# Altium schematic sheet TUSB4041_PINOUT.SchDoc
size C; SheetNumber: 17; SheetTotal: 21
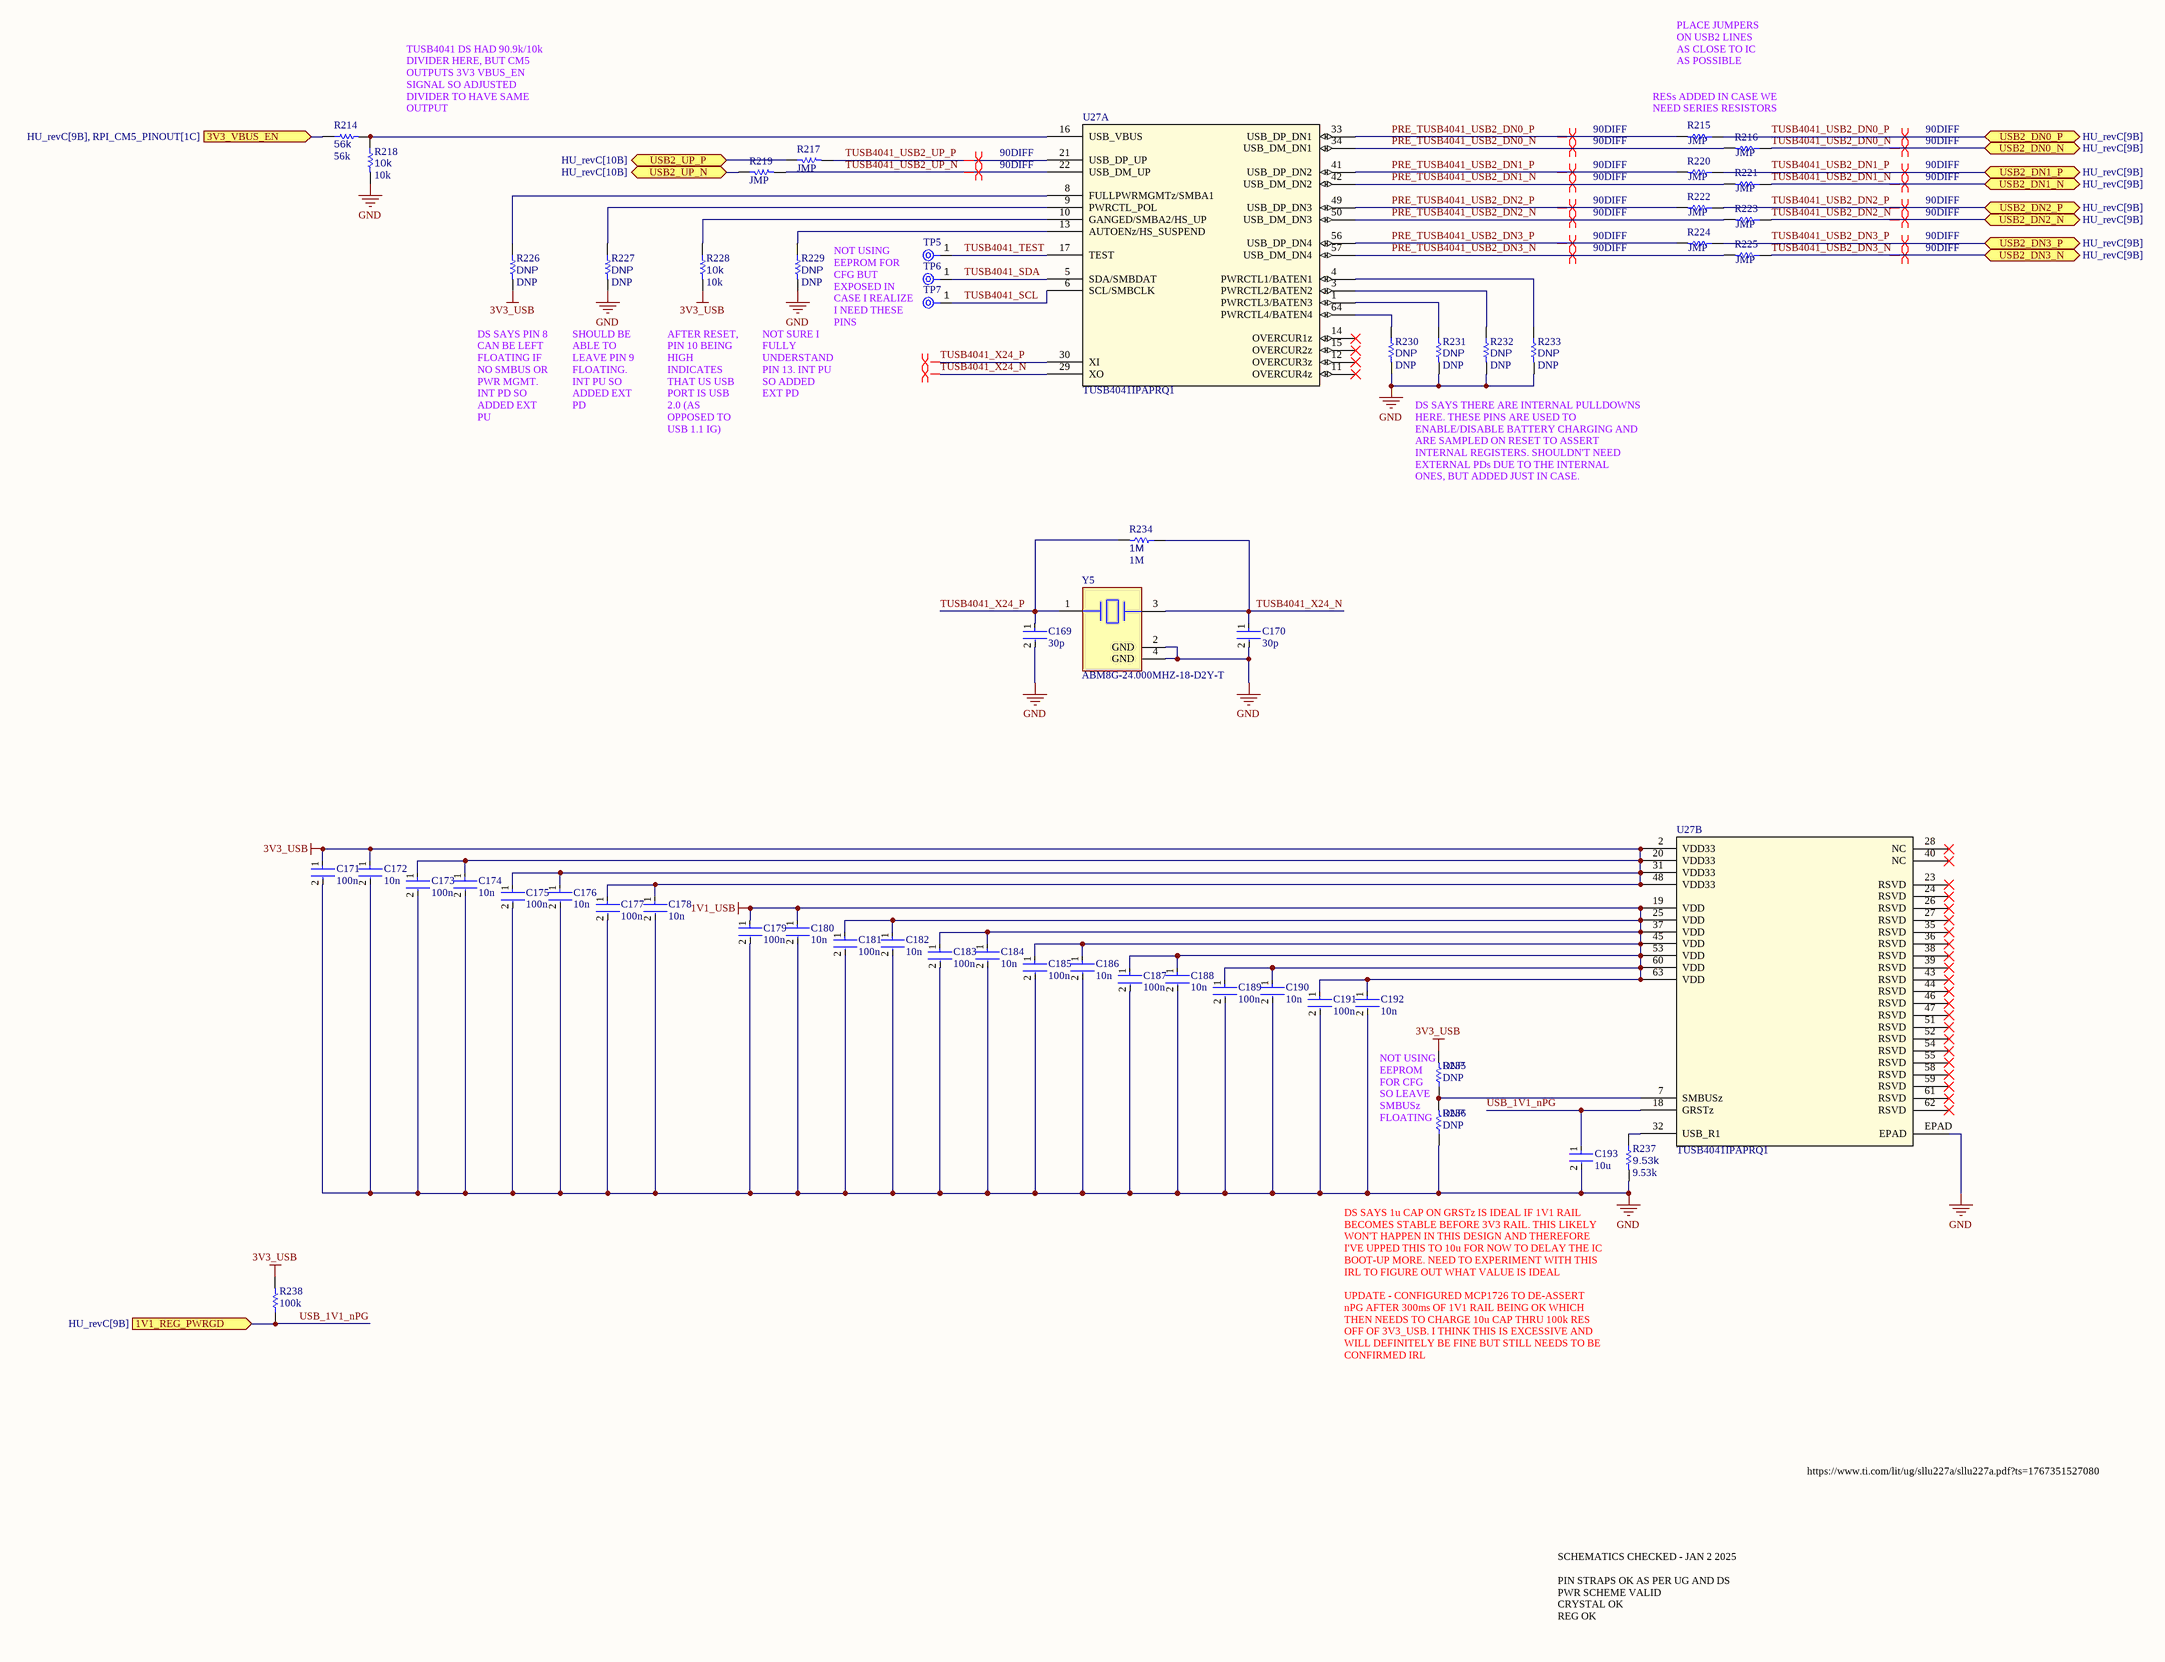
[diagram p0: TUSB4041_PINOUT.SchDoc]

## Parts
C169  30p  [FP-0402-L_1_0_0_05-W_0_5-IPC_A]
C170  30p  [FP-0402-L_1_0_0_05-W_0_5-IPC_A]
C171  100n  [FP-0402-L_1_0_0_05-W_0_5-IPC_A]
C172  10n  [FP-0402-L_1_0_0_05-W_0_5-IPC_A]
C173  100n  [FP-0402-L_1_0_0_05-W_0_5-IPC_A]
C174  10n  [FP-0402-L_1_0_0_05-W_0_5-IPC_A]
C175  100n  [FP-0402-L_1_0_0_05-W_0_5-IPC_A]
C176  10n  [FP-0402-L_1_0_0_05-W_0_5-IPC_A]
C177  100n  [FP-0402-L_1_0_0_05-W_0_5-IPC_A]
C178  10n  [FP-0402-L_1_0_0_05-W_0_5-IPC_A]
C179  100n  [FP-0402-L_1_0_0_05-W_0_5-IPC_A]
C180  10n  [FP-0402-L_1_0_0_05-W_0_5-IPC_A]
C181  100n  [FP-0402-L_1_0_0_05-W_0_5-IPC_A]
C182  10n  [FP-0402-L_1_0_0_05-W_0_5-IPC_A]
C183  100n  [FP-0402-L_1_0_0_05-W_0_5-IPC_A]
C184  10n  [FP-0402-L_1_0_0_05-W_0_5-IPC_A]
C185  100n  [FP-0402-L_1_0_0_05-W_0_5-IPC_A]
C186  10n  [FP-0402-L_1_0_0_05-W_0_5-IPC_A]
C187  100n  [FP-0402-L_1_0_0_05-W_0_5-IPC_A]
C188  10n  [FP-0402-L_1_0_0_05-W_0_5-IPC_A]
C189  100n  [FP-0402-L_1_0_0_05-W_0_5-IPC_A]
C190  10n  [FP-0402-L_1_0_0_05-W_0_5-IPC_A]
C191  100n  [FP-0402-L_1_0_0_05-W_0_5-IPC_A]
C192  10n  [FP-0402-L_1_0_0_05-W_0_5-IPC_A]
C193  10u  [FP-0402-L_1_0_0_05-W_0_5-IPC_A]
R214  56k  [R0603B]
R215  JMP  [R0603B]
R216  JMP  [R0603B]
R217  JMP  [R0603B]
R218  10k  [R0603B]
R219  JMP  [R0603B]
R220  JMP  [R0603B]
R221  JMP  [R0603B]
R222  JMP  [R0603B]
R223  JMP  [R0603B]
R224  JMP  [R0603B]
R225  JMP  [R0603B]
R226  DNP  [R0603B]
R227  DNP  [R0603B]
R228  10k  [R0603B]
R229  DNP  [R0603B]
R230  DNP  [R0603B]
R231  DNP  [R0603B]
R232  DNP  [R0603B]
R233  DNP  [R0603B]
R234  1M  [R0603B]
R235  DNP  [R0603B]
R236  DNP  [R0603B]
R237  9.53k  [R0603B]
R238  100k  [R0603B]
TP5  TPAD6R  [New footprint 1]  (value not drawn)  (no BOM)
TP6  TPAD6R  [New footprint 1]  (value not drawn)  (no BOM)
TP7  TPAD6R  [New footprint 1]  (value not drawn)  (no BOM)
U27  TUSB4041IPAPRQ1  [TUSB4041IPAPRQ1-Footprint-1]  (parts A,B of 2)
Y5  ABM8G-24.000MHZ-18-D2Y-T  [FP-ABM8G-MFG]

## Ports
1V1_REG_PWRGD (in, see HU_revC[9B]), 3V3_VBUS_EN (in, see HU_revC[9B], RPI_CM5_PINOUT[1C]), USB2_DN0_N (bidir, see HU_revC[9B]), USB2_DN0_P (bidir, see HU_revC[9B]), USB2_DN1_N (bidir, see HU_revC[9B]), USB2_DN1_P (bidir, see HU_revC[9B]), USB2_DN2_N (bidir, see HU_revC[9B]), USB2_DN2_P (bidir, see HU_revC[9B]), USB2_DN3_N (bidir, see HU_revC[9B]), USB2_DN3_P (bidir, see HU_revC[9B]), USB2_UP_N (bidir, see HU_revC[10B]), USB2_UP_P (bidir, see HU_revC[10B])

## Nets
1V1_USB: C179.1 C180.1 C181.1 C182.1 C183.1 C184.1 C185.1 C186.1 C187.1 C188.1 C189.1 C190.1 C191.1 C192.1 U27.19(VDD) U27.25(VDD) U27.37(VDD) U27.45(VDD) U27.53(VDD) U27.60(VDD) U27.63(VDD)
3V3_USB: C171.1 C172.1 C173.1 C174.1 C175.1 C176.1 C177.1 C178.1 R226.2 R228.2 R235.2 R238.2 U27.2(VDD33) U27.20(VDD33) U27.31(VDD33) U27.48(VDD33)
GND: C169.2 C170.2 C171.2 C172.2 C173.2 C174.2 C175.2 C176.2 C177.2 C178.2 C179.2 C180.2 C181.2 C182.2 C183.2 C184.2 C185.2 C186.2 C187.2 C188.2 C189.2 C190.2 C191.2 C192.2 C193.2 R218.2 R227.2 R229.2 R230.2 R231.2 R232.2 R233.2 R236.1 R237.2 U27.EPAD Y5.2(GND) Y5.4(GND)
3V3_VBUS_EN: R214.1 ; port 3V3_VBUS_EN
PRE_TUSB4041_USB2_DN0_N: R216.2 U27.34(USB_DM_DN1)
PRE_TUSB4041_USB2_DN0_P: R215.2 U27.33(USB_DP_DN1)
PRE_TUSB4041_USB2_DN1_N: R221.2 U27.42(USB_DM_DN2)
PRE_TUSB4041_USB2_DN1_P: R220.2 U27.41(USB_DP_DN2)
PRE_TUSB4041_USB2_DN2_N: R223.2 U27.50(USB_DM_DN3)
PRE_TUSB4041_USB2_DN2_P: R222.2 U27.49(USB_DP_DN3)
PRE_TUSB4041_USB2_DN3_N: R225.2 U27.57(USB_DM_DN4)
PRE_TUSB4041_USB2_DN3_P: R224.2 U27.56(USB_DP_DN4)
TUSB4041_SCL: TP7.1(TP) U27.6(SCL/SMBCLK)
TUSB4041_SDA: TP6.1(TP) U27.5(SDA/SMBDAT)
TUSB4041_TEST: TP5.1(TP) U27.17(TEST)
TUSB4041_USB2_DN0_N: R216.1 ; port USB2_DN0_N
TUSB4041_USB2_DN0_P: R215.1 ; port USB2_DN0_P
TUSB4041_USB2_DN1_N: R221.1 ; port USB2_DN1_N
TUSB4041_USB2_DN1_P: R220.1 ; port USB2_DN1_P
TUSB4041_USB2_DN2_N: R223.1 ; port USB2_DN2_N
TUSB4041_USB2_DN2_P: R222.1 ; port USB2_DN2_P
TUSB4041_USB2_DN3_N: R225.1 ; port USB2_DN3_N
TUSB4041_USB2_DN3_P: R224.1 ; port USB2_DN3_P
TUSB4041_USB2_UP_N: R219.2 U27.22(USB_DM_UP)
TUSB4041_USB2_UP_P: R217.2 U27.21(USB_DP_UP)
TUSB4041_X24_N: C170.1 R234.1 U27.29(XO) Y5.3
TUSB4041_X24_P: C169.1 R234.2 U27.30(XI) Y5.1
USB2_UP_N: R219.1 ; port USB2_UP_N
USB2_UP_P: R217.1 ; port USB2_UP_P
USB_1V1_nPG: C193.1 R238.1 U27.18(GRSTz) ; port 1V1_REG_PWRGD
NetR214_2: R214.2 R218.1 U27.16(USB_VBUS)
NetR226_1: R226.1 U27.8(FULLPWRMGMTz/SMBA1)
NetR227_1: R227.1 U27.9(PWRCTL_POL)
NetR228_1: R228.1 U27.10(GANGED/SMBA2/HS_UP)
NetR229_1: R229.1 U27.13(AUTOENz/HS_SUSPEND)
NetR230_1: R230.1 U27.64(PWRCTL4/BATEN4)
NetR231_1: R231.1 U27.1(PWRCTL3/BATEN3)
NetR232_1: R232.1 U27.3(PWRCTL2/BATEN2)
NetR233_1: R233.1 U27.4(PWRCTL1/BATEN1)
NetR235_1: R235.1 R236.2 U27.7(SMBUSz)
NetR237_1: R237.1 U27.32(USB_R1)

Not connected (* = marked no-connect by the designer): U27 11(OVERCUR4z)* 12(OVERCUR3z)* 14(OVERCUR1z)* 15(OVERCUR2z)* 23(RSVD)* 24(RSVD)* 26(RSVD)* 27(RSVD)* 28(NC)* 35(RSVD)* 36(RSVD)* 38(RSVD)* 39(RSVD)* 40(NC)* 43(RSVD)* 44(RSVD)* 46(RSVD)* 47(RSVD)* 51(RSVD)* 52(RSVD)* 54(RSVD)* 55(RSVD)* 58(RSVD)* 59(RSVD)* 61(RSVD)* 62(RSVD)*

## Layout directives
differential pair: TUSB4041_X24_N, TUSB4041_X24_P
differential pair; differential pair class 90DIFF: PRE_TUSB4041_USB2_DN0_N, PRE_TUSB4041_USB2_DN0_P, PRE_TUSB4041_USB2_DN1_N, PRE_TUSB4041_USB2_DN1_P, PRE_TUSB4041_USB2_DN2_N, PRE_TUSB4041_USB2_DN2_P, PRE_TUSB4041_USB2_DN3_N, PRE_TUSB4041_USB2_DN3_P, TUSB4041_USB2_DN0_N, TUSB4041_USB2_DN0_P, TUSB4041_USB2_DN1_N, TUSB4041_USB2_DN1_P, TUSB4041_USB2_DN2_N, TUSB4041_USB2_DN2_P, TUSB4041_USB2_DN3_N, TUSB4041_USB2_DN3_P, TUSB4041_USB2_UP_N, TUSB4041_USB2_UP_P

## Notes on the sheet
- PLACE JUMPERS ON USB2 LINES AS CLOSE TO IC AS POSSIBLE
- TUSB4041 DS HAD 90.9k/10k DIVIDER HERE, BUT CM5 OUTPUTS 3V3 VBUS_EN SIGNAL SO ADJUSTED DIVIDER TO HAVE SAME OUTPUT
- RESs ADDED IN CASE WE NEED SERIES RESISTORS
- NOT USING EEPROM FOR CFG BUT EXPOSED IN CASE I REALIZE I NEED THESE PINS
- DS SAYS PIN 8 CAN BE LEFT FLOATING IF NO SMBUS OR PWR MGMT. INT PD SO ADDED EXT PU
- SHOULD BE ABLE TO LEAVE PIN 9 FLOATING. INT PU SO ADDED EXT PD
- AFTER RESET, PIN 10 BEING HIGH INDICATES THAT US USB PORT IS USB 2.0 (AS OPPOSED TO USB 1.1 IG)
- NOT SURE I FULLY UNDERSTAND PIN 13. INT PU SO ADDED EXT PD
- DS SAYS THERE ARE INTERNAL PULLDOWNS HERE. THESE PINS ARE USED TO ENABLE/DISABLE BATTERY CHARGING AND ARE SAMPLED ON RESET TO ASSERT INTERNAL REGISTERS. SHOULDN'T NEED EXTERNAL PDs DUE TO THE INTERNAL ONES, BUT ADDED JUST IN CASE.
- NOT USING EEPROM FOR CFG SO LEAVE SMBUSz FLOATING
- DS SAYS 1u CAP ON GRSTz IS IDEAL IF 1V1 RAIL BECOMES STABLE BEFORE 3V3 RAIL. THIS LIKELY WON'T HAPPEN IN THIS DESIGN AND THEREFORE I'VE UPPED THIS TO 10u FOR NOW TO DELAY THE IC BOOT-UP MORE. NEED TO EXPERIMENT WITH THIS IRL TO FIGURE OUT WHAT VALUE IS IDEAL
- UPDATE - CONFIGURED MCP1726 TO DE-ASSERT nPG AFTER 300ms OF 1V1 RAIL BEING OK WHICH THEN NEEDS TO CHARGE 10u CAP THRU 100k RES OFF OF 3V3_USB. I THINK THIS IS EXCESSIVE AND WILL DEFINITELY BE FINE BUT STILL NEEDS TO BE CONFIRMED IRL
- https://www.ti.com/lit/ug/sllu227a/sllu227a.pdf?ts=1767351527080
- SCHEMATICS CHECKED - JAN 2 2025
  PIN STRAPS OK AS PER UG AND DS
  PWR SCHEME VALID
  CRYSTAL OK
  REG OK

## Library data of the parts
C169-C193 = CMP-001-00058-1: LARGE PADS, 0402 CAP, CHANGE COMMENT TO MATCH REAL P/N; Capacitor Type: Ceramic; Min Operating Temperature: -55°C; Mounting Technology: Surface Mount; Pins: 2; Case/Package: 0402; RoHS Compliant: Yes; Max Operating Temperature: 85°C
R214-R238 = CMP-009-00002-14: Resistor
  R214: Value: 56k
  R218 R228: Value: 10k
  R226 R227 R229-R233 R235 R236: Value: DNP
  R234: Value: 1M
  R237: Value: 9.53k
  R238: Value: 100k
TP5-TP7 = CMP-00025-3: Test Point .6mm
U27 = CMP-015-00024-1: IC USB 2.0 4PORT HUB 64HTQFP USB Hub Controller USB 2.0 USB Interface 64-HTQFP (10x10); Max Operating Temperature: 85°C; Pins: 64; Min Operating Temperature: -40°C
Y5 = CMP-27762-003871-2: Crystal 24MHz ±20ppm (Tol) ±30ppm (Stability) 18pF FUND 60Ω 4-Pin SMD T/R; ESR (Equivalent Series Resistance): 60R; Load Capacitance: 18pF; Height: 0.039inch; Operating Frequency: 24 MHz; Tolerance: 20ppm; Packaging: Tape and Reel; Case/Package: CSMD; Mount: Surface Mount; Number of Pins: 4; Length: 3.2mm; Series: ABM8G; Lead Free: Lead Free; Package Quantity: 1000; Series Resistance: 60R; Frequency Tolerance: 20ppm; Min Operating Temperature: -40°C; Termination: SMD/SMT; Radiation Hardening: No; Frequency: 24MHz; Frequency Stability: 30ppm; Depth: 2.5mm; Width: 0.098inch; Max Operating Temperature: 85°C